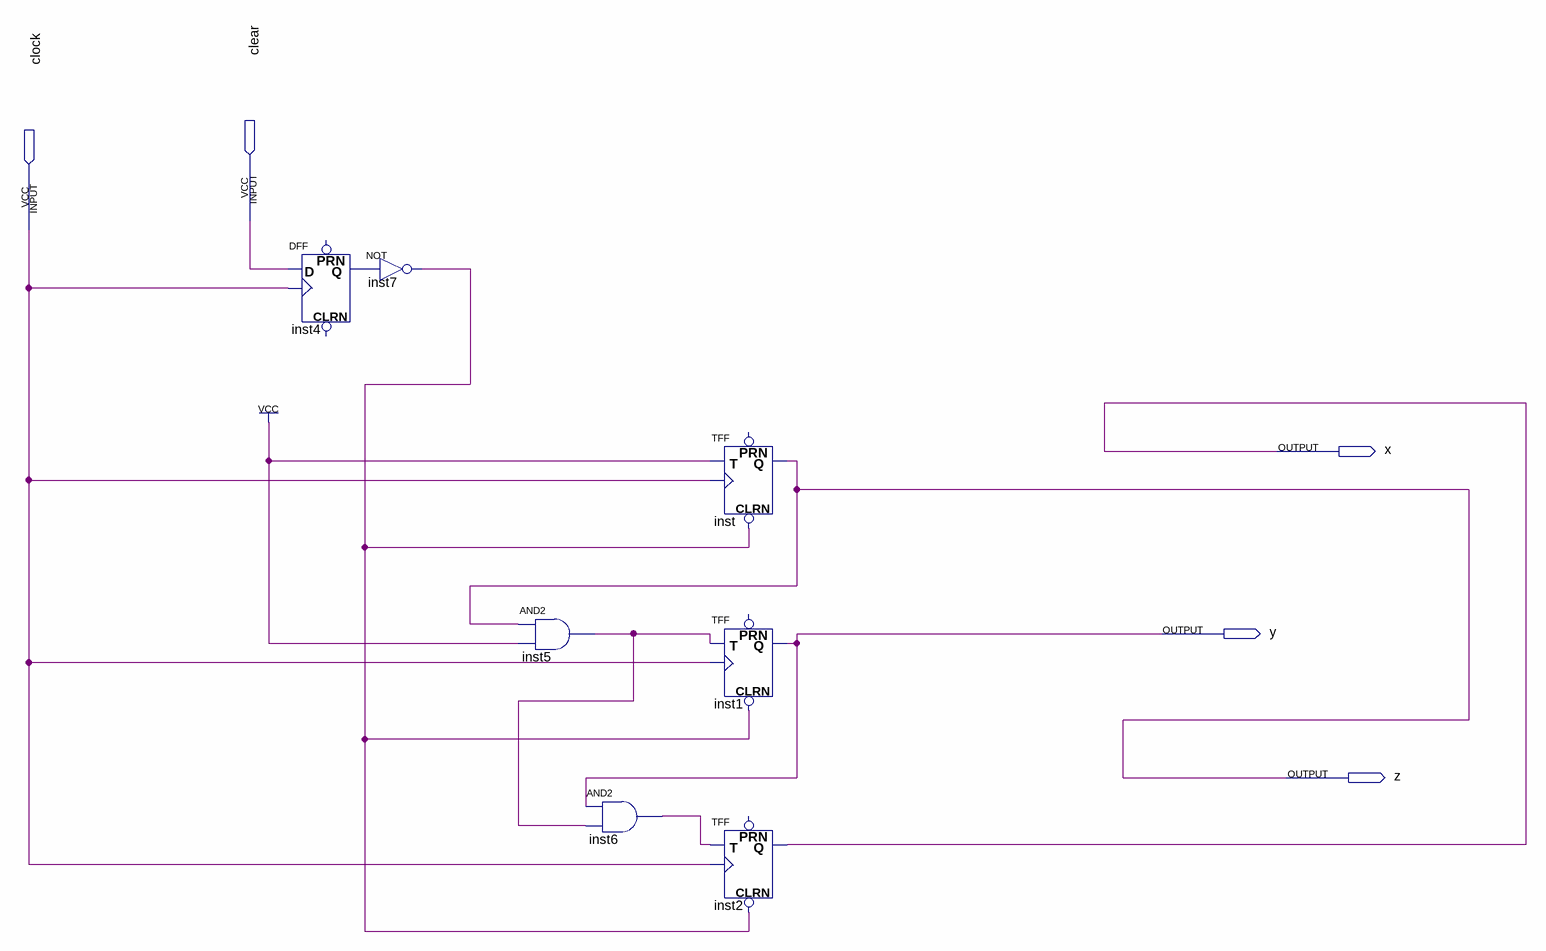
[diagram p0: schematic sheet]
// Quartus schematic cont.bdf as structural Verilog: 7 symbols, 5 pins
module cont (
  input  clear,
  input  clock,
  output x,
  output y,
  output z
);

  wire inst4_q, inst5_out, inst6_out, inst7_out;

  DFF inst4 (.CLK(clock), .D(clear), .Q(inst4_q));  // open: CLRN, PRN
  not inst7 (inst7_out, inst4_q);
  and inst5 (inst5_out, z, 1'b1);
  and inst6 (inst6_out, y, inst5_out);
  TFF inst (.CLRN(inst7_out), .T(1'b1), .CLK(clock), .Q(z));  // open: PRN
  TFF inst1 (.CLRN(inst7_out), .T(inst5_out), .CLK(clock), .Q(y));  // open: PRN
  TFF inst2 (.CLRN(inst7_out), .T(inst6_out), .CLK(clock), .Q(x));  // open: PRN
endmodule
